# Altium schematic sheet Power.SchDoc
size A4; SheetNumber: 4; SheetTotal: 4
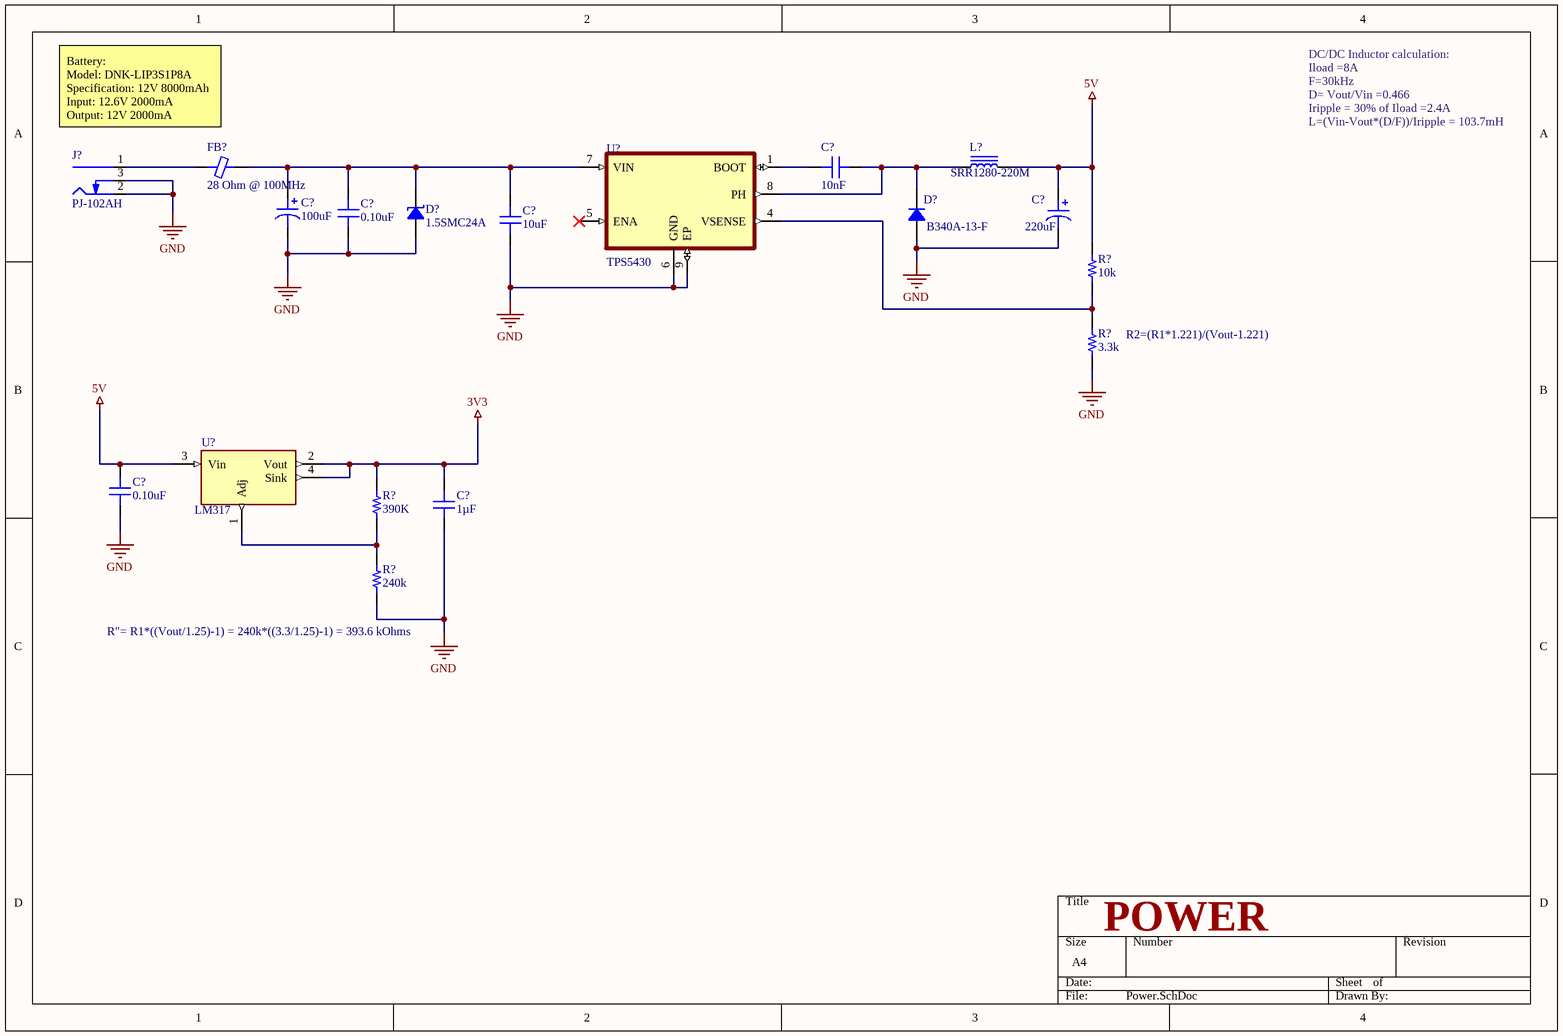
[diagram p0: Power.SchDoc]

## Parts
(Parts that share a designator on the sheet are numbered #1, #2 ... from top to bottom, then left to right.)
C?#1  10nF  [CAP 0805/2012]
C?#2  100uF  [CAP ALUM 10.3MM]
C?#3  0.10uF  [CAP 0603/1608]
C?#4  220uF  [CAP ALUM 10.3MM]
C?#5  10uF  [CAP 1210/3225 - 2.8MM]
C?#6  0.10uF  [CAP 0603/1608]
C?#7  1µF  [CAP 0805_2012]
D?#1  1.5SMC24A  [DO214AB SMC]
D?#2  B340A-13-F  [DO214AC SMA]
FB?  28 Ohm @ 100MHz  [FER 0603/1608]
J?  PJ-102AH  [CUI PJ-102AH]
L?  SRR1280-220M  [BOURNS SRR1280]
R?#1  10k  [RES 0603/1608]
R?#2  3.3k  [RES 0603/1608]
R?#3  390K  [RES 0603/1608]
R?#4  240k  [RES 0603/1608]
U?#1  TPS5430  [VREG_LM5017MR/NOPB]
U?#2  LM317  [TI SOT-223 DCY]

## Nets
3V3: C?#7.2 R?#3.2 U?#2.2(Vout) U?#2.4(Sink)
5V: C?#4.1 C?#6.2 L?.2 R?#1.2 U?#2.3(Vin)
GND: C?#2.2 C?#3.1 C?#4.2 C?#5.2 C?#6.1 C?#7.1 D?#1.1 D?#2.1 J?.2(Outer) J?.3(SW) R?#2.1 R?#4.1 U?#1.6(GND) U?#1.9(EP)
NetC?#1_1: C?#1.1 U?#1.1(BOOT)
NetC?#1_2: C?#1.2 D?#2.2 L?.1 U?#1.8(PH)
NetC?#2_1: C?#2.1 C?#3.2 C?#5.1 D?#1.2 FB?.2 U?#1.7(VIN)
NetFB?_1: FB?.1 J?.1(Centre)
NetR?#1_1: R?#1.1 R?#2.2 U?#1.4(VSENSE)
NetR?#3_1: R?#3.1 R?#4.2 U?#2.1(Adj)

Not connected (* = marked no-connect by the designer): U?#1 5(ENA)*

## Notes on the sheet
- Battery:
  Model: DNK-LIP3S1P8A
  Specification: 12V 8000mAh
  Input: 12.6V 2000mA
  Output: 12V 2000mA
- DC/DC Inductor calculation:
  Iload =8A
  F=30kHz
  D= Vout/Vin =0.466
  Iripple = 30% of Iload =2.4A
  L=(Vin-Vout*(D/F))/Iripple = 103.7mH
- (near R?#2) R2=(R1*1.221)/(Vout-1.221)
- (near R?#4) R"= R1*((Vout/1.25)-1) = 240k*((3.3/1.25)-1) = 393.6 kOhms
- POWER

## Library data of the parts
C?#1 = C0805C103K5RACAUTO: CAP CER 10000PF 50V X7R 0805; Manufacturer: Kemet; TemperatureRange: -55C ~ 125C; Tolerance: 10%; Value: 10nF; Part Number: C0805C103K5RACAUTO; PartId: 14086; Supplier 1: Digi-Key; Supplier Part Number 1: 399-6924-2-ND; ComponentLink1Description: Datasheet; ComponentLink1URL: http://www.kemet.com/docfinder?Partnumber=C0805C103K5RACAUTO; ComponentLink2Description: Digi-Key Listing; ComponentLink2URL: https://www.digikey.com/product-detail/en/kemet/C0805C103K5RACAUTO/399-6924-2-ND/3314918; TemperatureCoefficient: X7R; Voltage: 50V; Price: 0.0167; Device Package: 0805 (2012 Metric)
C?#2 = EEE-1HA101P: CAP ALUM 100UF 20% 50V SMD; Manufacturer: Panasonic Electronic Components; TemperatureRange: -40C ~ 85C; Type: Automotive; Ripple Current: 250mA; Lifetime @ Temp: 2000 Hrs @ 85C; Value: 100uF; Part Number: EEE-1HA101P; PartId: 7398; Supplier 1: Digi-Key; Supplier Part Number 1: PCE3916TR-ND; ComponentLink1Description: Datasheet; ComponentLink1URL: http://media.digikey.com/pdf/Data%20Sheets/Panasonic%20Electronic%20Components/S_Series_Type_V.pdf; ComponentLink2Description: Digi-Key listing; ComponentLink2URL: http://digikey.com/product-detail/en/EEE-1HA101P/PCE3916TR-ND/766083; Tolerance: 20%; Voltage: 50V; Price: 0.3144; Device Package: Radial, Can - SMD; Impedance: -
C?#3 C?#6 = C0603C104J3RACTU: CAP CER 0.1UF 25V X7R 0603; Manufacturer: Kemet; TemperatureRange: -55C ~ 125C; Tolerance: 5%; Value: 0.10uF; Part Number: C0603C104J3RACTU; PartId: 13224; Supplier 1: Digi-Key; Supplier Part Number 1: 399-1282-2-ND; ComponentLink1Description: Datasheet; ComponentLink1URL: http://www.kemet.com/docfinder?Partnumber=C0603C104J3RACTU; ComponentLink2Description: Digi-Key Listing; ComponentLink2URL: https://www.digikey.com/product-detail/en/kemet/C0603C104J3RACTU/399-1282-2-ND/416045; TemperatureCoefficient: X7R; Voltage: 25V; Price: 0.0714; Device Package: 0603 (1608 Metric)
C?#4 = 875075561008: CAP POLYMER 220UF 20% 25V SMD; Manufacturer: Wurth Electronics Inc; TemperatureRange: -55C ~ 105C; Type: General Purpose; Ripple Current: 4.8A; Lifetime @ Temp: 2000 Hrs @ 105C; Value: 220uF; Part Number: 875075561008; PartId: 7727; Supplier 1: Digi-Key; Supplier Part Number 1: 732-6502-2-ND; ComponentLink1Description: Datasheet; ComponentLink1URL: http://katalog.we-online.de/pbs/datasheet/875075561008.pdf; ComponentLink2Description: Digi-Key listing; ComponentLink2URL: http://digikey.com/product-detail/en/875075561008/732-6502-2-ND/5147666; Tolerance: 20%; Voltage: 25V; Price: 1.8044; Device Package: Radial, Can - SMD; Impedance: -
C?#5 = 12105C106KAT2A: CAP CER 10UF 50V X7R 1210; Manufacturer: AVX Corporation; TemperatureRange: -55C ~ 125C; Tolerance: 10%; Value: 10uF; Part Number: 12105C106KAT2A; PartId: 19201; Supplier 1: Digi-Key; Supplier Part Number 1: 478-9912-2-ND; ComponentLink1Description: Datasheet; ComponentLink1URL: http://datasheets.avx.com/X7RDielectric.pdf; ComponentLink2Description: Digi-Key Listing; ComponentLink2URL: https://www.digikey.com/product-detail/en/avx-corporation/12105C106KAT2A/478-9912-2-ND/6006191; TemperatureCoefficient: X7R; Voltage: 50V; Price: 0.2813; Device Package: 1210 (3225 Metric)
C?#7 = CL21A105KBCLNNC: CAP CER 1UF 50V X5R 0805; Manufacturer: Samsung Electro-Mechanics; Tolerance: ±10%; Part Number: CL21A105KBCLNNC; Value: 1µF; Applications: General Purpose; Capacitance: 1µF; ComponentLink1Description: Datasheet; ComponentLink1URL: http://www.samsungsem.com/kr/support/product-search/mlcc/CL21A105KBCLNNC.jsp; ComponentLink2Description: DigiKey Link; ComponentLink2URL: http://digikey.com/product-detail/en/samsung-electro-mechanics/CL21A105KBCLNNC/1276-2396-1-ND/3890482; Device Package: 0805 (2012 Metric); Features: Low Profile; LastUpdated: 9/2/2020 1:04:16 AM; Lifecycle Status: Active; Minimum Order: 1; Mounting Type: Surface Mount, MLCC; Operating Temperature: -55°C ~ 85°C; Package / Case: 0805 (2012 Metric); Packaging: TapeAndReel; PartId: 15373; Part Status: Active; Price: 0.03; Series: CL; Size / Dimension: 0.079" L x 0.049" W (2.00mm x 1.25mm); Supplier 1: DigiKey; Supplier Part Number 1: 1276-2396-1-ND; Temperature Coefficient: X5R; Thickness (Max): 0.037" (0.95mm); Voltage - Rated: 50V
D?#1 = 1.5SMC24A: TVS DIODE 20.5V 33.2V DO214AB; Manufacturer: Littelfuse Inc.; Current - Peak Pulse (10/1000µs): 45.8A; Power Line Protection: No; Power - Peak Pulse: 1500W (1.5kW); Type: Zener; Unidirectional Channels: 1; Voltage - Breakdown (Min): 22.8V; Part Number: 1.5SMC24A; Applications: General Purpose; ComponentLink1Description: Datasheet; ComponentLink1URL: https://www.littelfuse.com/~/media/electronics/datasheets/tvs_diodes/littelfuse_tvs_diode_1_5smc_datasheet.pdf.pdf; ComponentLink2Description: DigiKey Link; ComponentLink2URL: http://digikey.com/product-detail/en/littelfuse-inc/1.5SMC24A/1.5SMC24ACT-ND/1835386; LastUpdated: 9/2/2020 1:20:00 AM; Lifecycle Status: Active; Minimum Order: 1; Mounting Type: Surface Mount; Operating Temperature: -55°C ~ 150°C (TJ); Package / Case: DO-214AB, SMC; Packaging: TapeAndReel; PartId: 6399; Part Status: Active; Price: 0.18; Series: 1.5SMC; Supplier 1: DigiKey; Supplier Part Number 1: 1.5SMC24ACT-ND; Supplier Device Package: DO-214AB (SMCJ); Voltage - Clamping (Max) @ Ipp: 33.2V; Voltage - Reverse Standoff (Typ): 20.5V
D?#2 = B340A-13-F: DIODE SCHOTTKY 40V 3A SMA; Manufacturer: Diodes Incorporated; Current Reverse Leakage @ Vr: 500uA @ 40V; Voltage Forward (Vf): 500mV @ 3A; Part Number: B340A-13-F; PartId: 16333; Supplier 1: Digi-Key; Supplier Part Number 1: B340A-FDITR-ND; ComponentLink1Description: Datasheet; ComponentLink1URL: http://www.diodes.com/_files/datasheets/ds30891.pdf; ComponentLink2Description: Digi-Key Listing; ComponentLink2URL: https://www.digikey.com/product-detail/en/diodes-incorporated/B340A-13-F/B340A-FDITR-ND/725015; Junction Operating Temperature: -55C ~ 150C; Price: 0.1085; Type: Schottky; Device Package: DO-214AC, SMA; Voltage DC Reverse (Vr): 40V; Current Rectified: 3A
FB? = 742792603: FERRITE CHIP 28 OHM 4.0A 0603; Manufacturer: Wurth Electronics Inc; Type: Differential Mode - Single; DC Resistance: 30 mOhm Max; Current Rating: 4A; Part Number: 742792603; PartId: 6745; Value: 28 Ohm @ 100MHz; Supplier 1: Digi-Key; Supplier Part Number 1: 732-1590-2-ND; ComponentLink1Description: Datasheet; ComponentLink1URL: http://katalog.we-online.de/pbs/datasheet/742792603.pdf; ComponentLink2Description: Digi-Key listing; ComponentLink2URL: http://digikey.com/product-detail/en/742792603/732-1590-2-ND/1638994; Price: 0.1829; Device Package: 0603 (1608 Metric)
J? = PJ-102AH: CONN PWR JACK 2X5.5MM SOLDER; Manufacturer: CUI Devices; Actual Diameter: 0.079" (2.00mm ID), 0.256" (6.50mm OD); Current Rating (Amps): 5A; Gender: Male; Industry Recognized Mating Diameter: 2.00mm ID (0.079"), 5.50mm OD (0.217"); Internal Switch(s): Single Switch, Normally Closed; Material Flammability Rating: UL94 V-0; Mating Length/Depth: 0.354" (9.00mm); Number of Positions/Contacts: 2 Conductors, 3 Contacts; Shielding: Unshielded; Voltage - Rated: 24VDC; Part Number: PJ-102AH; ComponentLink1Description: Datasheet; ComponentLink1URL: https://www.cuidevices.com/product/resource/digikeypdf/pj-102ah.pdf; ComponentLink2Description: DigiKey Link; ComponentLink2URL: //digikey.com/product-detail/en/cui-devices/PJ-102AH/CP-102AH-ND/408448; Connector Type: Jack; LastUpdated: 12/16/2019 7:01:27 PM; Lifecycle Status: 0; Minimum Order: 1; Mounting Type: Through Hole, Right Angle; Packaging: Tray; Part Status: Active; Price: 0.76; Series: -; Supplier 1: DigiKey; Supplier Part Number 1: CP-102AH-ND; Termination: Solder
L? = SRR1280-220M: FIXED IND 22UH 4.3A 38.6 MOHM; Manufacturer: Bourns Inc.; Type: Wirewound; Material - Core: Ferrite; Tolerance: 20%; Current - Saturation: 4.1A; Shielding: Shielded; DC Resistance (DCR): 38.6 mOhm Max; Q @ Freq: 20 @ 2.52MHz; Frequency - Self Resonant: 11MHz; Value: 22uH; Part Number: SRR1280-220M; PartId: 15714; Supplier 1: Digi-Key; Supplier Part Number 1: SRR1280-220MTR-ND; ComponentLink1Description: Datasheet; ComponentLink1URL: http://www.bourns.com/docs/Product-Datasheets/SRR1280.pdf; ComponentLink2Description: Digi-Key Listing; ComponentLink2URL: https://www.digikey.com/product-detail/en/bourns-inc/SRR1280-220M/SRR1280-220MTR-ND/1969996; Price: 0.7737; Device Package: Nonstandard; Series: SRR1280; Inductance: 22uH; Current Rating: 4.3A; Operating Temperature: -40C ~ 125C
R?#1 = ERA-3AEB103V: RES SMD 10K OHM 0.1% 1/10W 0603; Manufacturer: Panasonic Electronic Components; TemperatureRange: -55C ~ 155C; TemperatureCoefficient: 25ppm/C; PowerRating: 0.1W, 1/10W; Value: 10k; Part Number: ERA-3AEB103V; PartId: 1432; Supplier 1: Digi-Key; Supplier Part Number 1: P10KDBTR-ND; ComponentLink1Description: Datasheet; ComponentLink1URL: http://industrial.panasonic.com/lecs/www-data/pdf/AOA0000/AOA0000CE26.pdf; ComponentLink2Description: Digi-Key listing; ComponentLink2URL: http://digikey.com/product-detail/en/ERA-3AEB103V/P10KDBTR-ND/1465878; Tolerance: 0.1%; Price: 0.055; Type: Thin Film; Device Package: 0603 (1608 Metric)
R?#2 = ERA-3APB332V: RES SMD 3.3K OHM 0.1% 1/10W 0603; Manufacturer: Panasonic Electronic Components; TemperatureRange: -55C ~ 155C; TemperatureCoefficient: 15ppm/C; PowerRating: 0.1W, 1/10W; Value: 3.3k; Part Number: ERA-3APB332V; PartId: 1857; Supplier 1: Digi-Key; Supplier Part Number 1: P3.3KAYTR-ND; ComponentLink1Description: Datasheet; ComponentLink1URL: http://industrial.panasonic.com/lecs/www-data/pdf/AOA0000/AOA0000CE26.pdf; ComponentLink2Description: Digi-Key listing; ComponentLink2URL: http://digikey.com/product-detail/en/ERA-3APB332V/P3.3KAYTR-ND/3070646; Tolerance: 0.1%; Price: 0.2873; Type: Thin Film; Device Package: 0603 (1608 Metric)
R?#3 = 0603S8J0394: RES SMD 390K OHM 5% 1/8W 0603; Manufacturer: Uniohm; TemperatureRange: -55C ~ 155C; TemperatureCoefficient: 100ppm/C; PowerRating: 0.125W, 1/8W; Value: 390K; Part Number: 0603S8J0394; Tolerance: 5%; Price: 0.0089; Device Package: 1608 (0603 Metric)
R?#4 = ERJ-3EKF2403V: RES SMD 240K OHM 1% 1/10W 0603; Manufacturer: Panasonic Electronic Components; TemperatureRange: -55C ~ 155C; TemperatureCoefficient: 100ppm/C; PowerRating: 0.1W, 1/10W; Value: 240k; Part Number: ERJ-3EKF2403V; PartId: 1186; Supplier 1: Digi-Key; Supplier Part Number 1: P240KHTR-ND; ComponentLink1Description: Datasheet; ComponentLink1URL: http://industrial.panasonic.com/www-cgi/jvcr13pz.cgi?E+PZ+3+AOA0002+ERJ3EKF2403V+7+WW; ComponentLink2Description: Digi-Key listing; ComponentLink2URL: http://digikey.com/product-detail/en/ERJ-3EKF2403V/P240KHTR-ND/1746349; Tolerance: 1%; Price: 0.0038; Type: Thick Film; Device Package: 0603 (1608 Metric)
U?#1 = TPS5430DDA: CONVERTER 5.5V-36 to 5.5V; MF: Texas Instruments; Availability: Unavailable; Mouser-Purchase-URL: https://snapeda.com/shop?store=Mouser&id=226174; Texas_Instruments-Purchase-URL: https://snapeda.com/shop?store=Texas+Instruments&id=226174; Package: HSOIC-8 Texas Instruments; Price: None; SnapEDA_Link: https://www.snapeda.com/parts/TPS5430DDA/Texas%20Instruments/view-part/226174/?ref=snap; MP: TPS5430DDA; DigiKey-Purchase-URL: https://snapeda.com/shop?store=DigiKey&id=226174; Value: *
U?#2 = LM317DCVR: Adjustable voltage regulator, 1.5A, output range 1.25 - 37 V